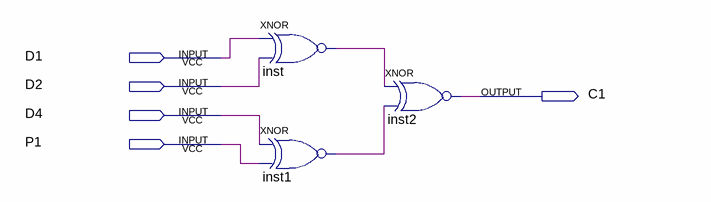
[diagram p0: schematic sheet]
// Quartus schematic check_c1.bdf as structural Verilog: 3 symbols, 5 pins
module check_c1 (
  input  D1,
  input  D2,
  input  D4,
  input  P1,
  output C1
);

  wire inst1_out, inst_out;

  xnor inst (inst_out, D1, D2);
  xnor inst1 (inst1_out, D4, P1);
  xnor inst2 (C1, inst_out, inst1_out);
endmodule
